# Altium schematic sheet Sheet_2022-02-13.schdoc
size 157 x 168 mm
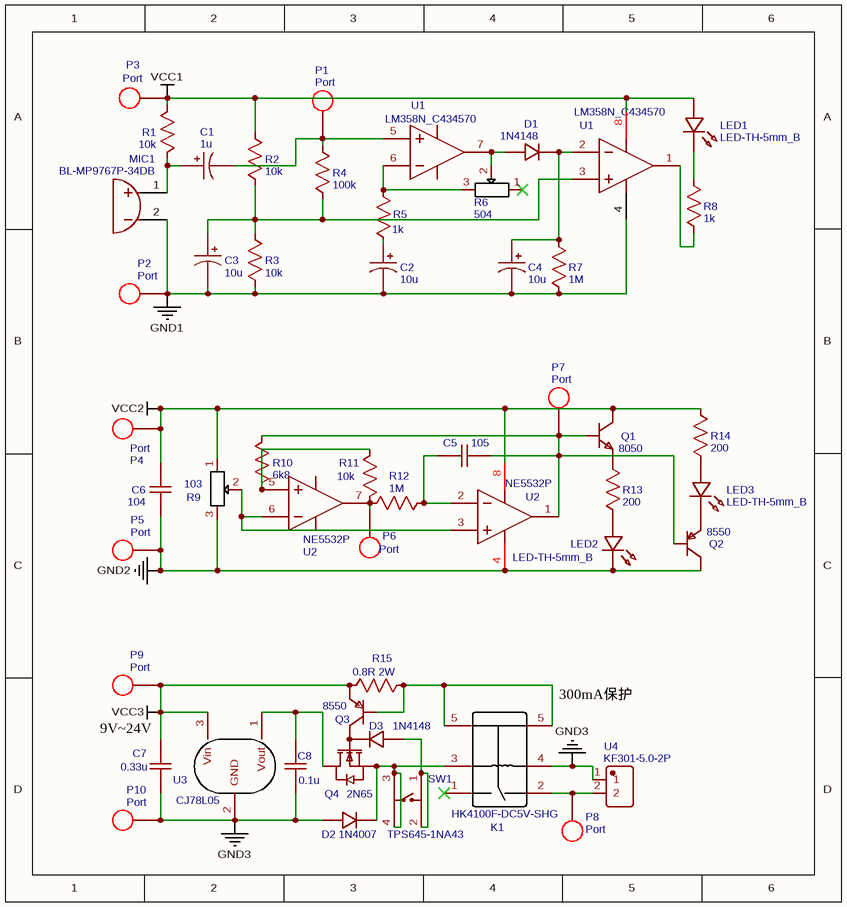
[diagram p0: Sheet_2022-02-13.schdoc]

## Parts
(Parts that share a designator on the sheet are numbered #1, #2 ... from top to bottom, then left to right.)
C1  1u  [CAP-D5.0×F2.0]
C2  10u  [CAP-D5.0×F2.0]
C3  10u  [CAP-D5.0×F2.0]
C4  10u  [CAP-D5.0×F2.0]
C5  105  [RAD-0.2]
C6  104  [RAD-0.2]
C7  0.33u  [C0805]
C8  0.1u  [C0805]
D1  1N4148  [DO-35_BD2.0-L4.2-P8.20-D0.5-RD]
D2  1N4007  [DO-35_BD2.0-L4.2-P8.20-D0.5-RD]
D3  1N4148  [DO-35]
K1  HK4100F-DC5V-SHG  [RELAY-TH_HK4100F-DC5V-SHG]
LED1  LED-TH-5mm_B  [LED-TH_BD5.0_BLUE]
LED2  LED-TH-5mm_B  [LED-TH_BD5.0_BLUE]
LED3  LED-TH-5mm_B  [LED-TH_BD5.0_BLUE]
MIC1  BL-MP9767P-34DB  [MIC-TH_BD9.7-P2.54-D0.8-L-FD]
P1  Port  [测试点2.0]
P2  Port  [测试点2.0]
P3  Port  [测试点2.0]
P4  Port  [测试点2.0]
P5  Port  [测试点2.0]
P6  Port  [测试点2.0]
P7  Port  [测试点2.0]
P8  Port  [测试点2.0]
P9  Port  [测试点2.0]
P10  Port  [测试点2.0]
Q1  8050  [TO-92-3_L4.8-W3.7-P2.54-L]
Q2  8550  [TO-92-3_L4.8-W3.7-P2.54-L]
Q3  8550  [TO-126F-3L_L8.0-W3.2-P2.30-L]
Q4  2N65  [TO-251_L6.5-W2.3-P2.30-L]
R1  10k  [R_AXIAL-0.4]
R2  10k  [R_AXIAL-0.4]
R3  10k  [R_AXIAL-0.4]
R4  100k  [R_AXIAL-0.4]
R5  1k  [R_AXIAL-0.4]
R6  504  [pot3306F]
R7  1M  [R_AXIAL-0.4]
R8  1k  [R_AXIAL-0.4]
R9  103  [卧式蓝白电位器]
R10  6k8  [R_AXIAL-0.4]
R11  10k  [R_AXIAL-0.4]
R12  1M  [R_AXIAL-0.4]
R13  200  [R_AXIAL-0.4]
R14  200  [R_AXIAL-0.4]
R15  0.8R 2W  [R_AXIAL-0.8]
SW1  TPS645-1NA43  [TSW DIP-6*6*6]
U1#1  LM358N_C434570  [DIP-8_L9.2-W6.3-P2.54-LS7.62-BL]
U1#2  LM358N_C434570  [DIP-8_L9.2-W6.3-P2.54-LS7.62-BL]
U2#1  NE5532P  [DIP-8_L9.4-W6.4-P2.54-LS9.1-BL]
U2#2  NE5532P  [DIP-8_L9.4-W6.4-P2.54-LS9.1-BL]
U3  CJ78L05  [SOT-89-3_L4.5-W2.5-P1.50-LS4.2-BR]
U4  KF301-5.0-2P  [CONN-TH_P5.00_KF301-5.0-2P]

## Nets
GND1: C2.2 C3.2 C4.2 MIC1.2 P2.1 R3.1 R7.1 U1#2.4(GND)
GND2: C6.1 LED2.2 P5.1 Q2.3(C) R9.3 U2#2.4(VCC-)
GND3: C7.1 C8.1 D2.2 K1.4 P10.1 U3.2(GND) U4.1
VCC1: LED1.1 P3.1 R1.2 R2.2 U1#2.8(VCC)
VCC2: C6.2 P4.1 Q1.3(C) R9.1 R14.2 U2#2.8(VCC+)
VCC3: C7.2 P9.1 Q3.1(E) R15.1 U3.3(Vin)
NetC1_1: C1.1 MIC1.1 R1.1
NetC1_2: C1.2 P1.1 R4.2 U1#1.5(IN2+)
NetC2_1: C2.1 R5.1
NetC3_1: C3.1 R2.1 R3.2 R4.1 U1#2.3(IN1+)
NetC4_1: C4.1 D1.1 R7.2 U1#2.2(IN1-)
NetC5_1: C5.1 R12.2 U2#2.2(IN1-)
NetC5_2: C5.2 P7.1 Q1.2(B) Q2.2(B) R10.2 U2#2.1(OUT1)
NetC8_2: C8.2 Q4.2(D) U3.1(Vout)
NetD1_2: D1.2 R6.2 U1#1.7(OU2)
NetD2_1: D2.1 K1.3 Q4.3(S) SW1.3 SW1.4
NetD3_1: D3.1 Q3.3(C) Q4.1(G)
NetD3_2: D3.2 SW1.1 SW1.2
NetK1_2: K1.2 P8.1 U4.2
NetK1_5: K1.5 Q3.2(B) R15.2
NetLED1_2: LED1.2 R8.2
NetLED2_1: LED2.1 R13.1
NetLED3_1: LED3.1 R14.1
NetLED3_2: LED3.2 Q2.1(E)
NetP6_1: P6.1 R11.1 R12.1 U2#1.7(OUT2)
NetQ1_1: Q1.1(E) R13.2
NetR5_2: R5.2 R6.3 U1#1.6(IN2-)
NetR8_1: R8.1 U1#2.1(OUT1)
NetR9_2: R9.2 U2#1.6(IN2-) U2#2.3(IN1+)
NetR10_1: R10.1 R11.2 U2#1.5(IN2+)

Not connected (* = marked no-connect by the designer): K1 1*; R6 1*

## Notes on the sheet
- (near K1) 300mA保护
- 9V~24V

## Library data of the parts
C1 = 1u: nameAlias: Value(F); Contributor: LCEDA_Lib; spicePre: C; spiceSymbolName: CE_TH_D5.0×F2.0_US
C2-C4 = 10u: nameAlias: Value(F); Contributor: LCEDA_Lib; spicePre: C; spiceSymbolName: CE_TH_D5.0×F2.0_US
C5 = 105: nameAlias: Value(F); Contributor: LCEDA_Lib; spicePre: C; spiceSymbolName: C_RAD-0.2_US
C6 = 104: nameAlias: Value(F); Contributor: LCEDA_Lib; spicePre: C; spiceSymbolName: C_RAD-0.2_US
C7 = 0.33u: nameAlias: Value(F); Contributor: LCEDA_Lib; spicePre: C; spiceSymbolName: C_0805_US
C8 = 0.1u: nameAlias: Value(F); Contributor: LCEDA_Lib; spicePre: C; spiceSymbolName: C_0805_US
D1 = 1N4148: BOM_Manufacturer: STMicroelectronics; Contributor: LCSC; BOM_Supplier: LCSC; BOM_Supplier Part: C13769; BOM_Manufacturer Part: 1N4148; spicePre: D; spiceSymbolName: 1N4148
D2 = 1N4007: BOM_Manufacturer: STMicroelectronics; BOM_Manufacturer Part: 1N4148; Contributor: LCSC; BOM_Supplier: LCSC; BOM_Supplier Part: C13769; spicePre: D; spiceSymbolName: 1N4148
D3 = 1N4148: pin to pad: 1>2 2>1; BOM_Manufacturer: STMicroelectronics; Contributor: LCSC; BOM_Supplier: LCSC; BOM_Supplier Part: C13769; BOM_Manufacturer Part: 1N4148; spicePre: D; spiceSymbolName: 1N4148
K1 = HK4100F-DC5V-SHG: BOM_Manufacturer: HUIKE; BOM_Supplier: LCSC; BOM_Manufacturer Part: HK4100F-DC5V-SHG; BOM_Supplier Part: C12072; BOM_JLCPCB Part Class: Extended Part; spicePre: K; spiceSymbolName: HK4100F-DC5V-SHG
LED1-LED3 = LED-TH-5mm_B: Contributor: LCEDA_Lib; BOM_Supplier: LCSC; spicePre: L; spiceSymbolName: LED-TH-5mm_B
MIC1 = BL-MP9767P-34DB: BOM_Manufacturer: Dongguan Bolin Elec; Contributor: LCSC; BOM_Supplier: LCSC; BOM_Supplier Part: C220377; BOM_Manufacturer Part: BL-MP9767P-34DB; spicePre: M; spiceSymbolName: BL-MP9767P-34DB
P1-P10 = Port: Contributor: yzfv123; spicePre: P; spiceSymbolName: Port
Q1 = 8050: BOM_Manufacturer: SEMTECH; BOM_Manufacturer Part: 2N3904; Contributor: LCEDA_Lib; BOM_Supplier: LCSC; BOM_Supplier Part: C118538; spicePre: Q; spiceSymbolName: 2N3904(TO-92)
Q2 = 8550: BOM_Manufacturer: CJ; BOM_Manufacturer Part: 2N3906; Contributor: LCEDA_Lib; BOM_Supplier: LCSC; BOM_Supplier Part: C9809; spicePre: Q; spiceSymbolName: 2N3906(TO-92)
Q3 = 8550: BOM_Manufacturer: CJ; BOM_Manufacturer Part: B772; BOM_Supplier: LCSC; BOM_Supplier Part: C54523; BOM_JLCPCB Part Class: Extended Part; spicePre: Q; spiceSymbolName: B772_C54523
Q4 = 2N65: BOM_Manufacturer: SILAN(士兰微); BOM_Manufacturer Part: SVF2N70MJ; Contributor: LCSC; BOM_Supplier: LCSC; BOM_Supplier Part: C2761791; BOM_JLCPCB Part Class: Extended Part; spicePre: Q; spiceSymbolName: SVF2N70MJ
R1-R3 R11 = 10k: nameAlias: Value(Ω); Contributor: LCEDA_Lib; spicePre: R; spiceSymbolName: R_AXIAL-0.4_US
R4 = 100k: nameAlias: Value(Ω); Contributor: LCEDA_Lib; spicePre: R; spiceSymbolName: R_AXIAL-0.4_US
R5 R8 = 1k: nameAlias: Value(Ω); Contributor: LCEDA_Lib; spicePre: R; spiceSymbolName: R_AXIAL-0.4_US
R6 = 504: pin to pad: 1>2 2>3 3>1; Contributor: 218418A; spicePre: R; spiceSymbolName: 卧式蓝白电位器
R7 R12 = 1M: nameAlias: Value(Ω); Contributor: LCEDA_Lib; spicePre: R; spiceSymbolName: R_AXIAL-0.4_US
R9 = 103: Contributor: 218418A; spicePre: R; spiceSymbolName: 卧式蓝白电位器
R10 = 6k8: nameAlias: Value(Ω); Contributor: LCEDA_Lib; spicePre: R; spiceSymbolName: R_AXIAL-0.4_US
R13 R14 = 200: nameAlias: Value(Ω); Contributor: LCEDA_Lib; spicePre: R; spiceSymbolName: R_AXIAL-0.4_US
R15 = 0.8R 2W: nameAlias: Value(Ω); Contributor: LCEDA_Lib; spicePre: R; spiceSymbolName: R_AXIAL-0.8_US
SW1 = TPS645-1NA43: BOM_Manufacturer: ROCPU(台普); Contributor: LCSC; BOM_Supplier: LCSC; BOM_Supplier Part: C2828575; BOM_Manufacturer Part: TPS645-1NA43; BOM_JLCPCB Part Class: Extended Part; spicePre: S; spiceSymbolName: TPS645-1NA43
U1#1 U1#2 = LM358N_C434570: BOM_Manufacturer: HGSEMI; BOM_Manufacturer Part: LM358N; subpart_no: 1; Contributor: LCSC; BOM_Supplier: LCSC; BOM_Supplier Part: C434570; BOM_JLCPCB Part Class: Extended Part; spicePre: U; spiceSymbolName: LM358N_C434570
U2#1 U2#2 = NE5532P: BOM_Manufacturer: TI; subpart_no: 1; tags: Audio Operational Amplifier; timeStamp: 1460221582; BOM_Supplier Part: C5326; BOM_Supplier: LCSC; BOM_Manufacturer Part: NE5532P; image: http://image.lceda.cn/szlcsc/C5326.jpg; BOM_JLCPCB Part Class: Extended Part; spicePre: U; spiceSymbolName: NE5532P
U3 = CJ78L05: BOM_Manufacturer: CJ; BOM_Supplier: LCSC; BOM_Manufacturer Part: CJ78L05; BOM_Supplier Part: C2079; BOM_JLCPCB Part Class: Extended Part; spicePre: U; spiceSymbolName: CJ78L05
U4 = KF301-5.0-2P: BOM_Manufacturer: Cixi Kefa Elec; Contributor: LCSC; BOM_Supplier: LCSC; BOM_Supplier Part: C474881; BOM_Manufacturer Part: KF301-5.0-2P; BOM_JLCPCB Part Class: Extended Part; spicePre: U; spiceSymbolName: KF301-5.0-2P